# Altium schematic sheet ESQUEMÁTICOAUTOOSCILANTE.SchDoc
size A4; SheetNumber: 1; SheetTotal: 1
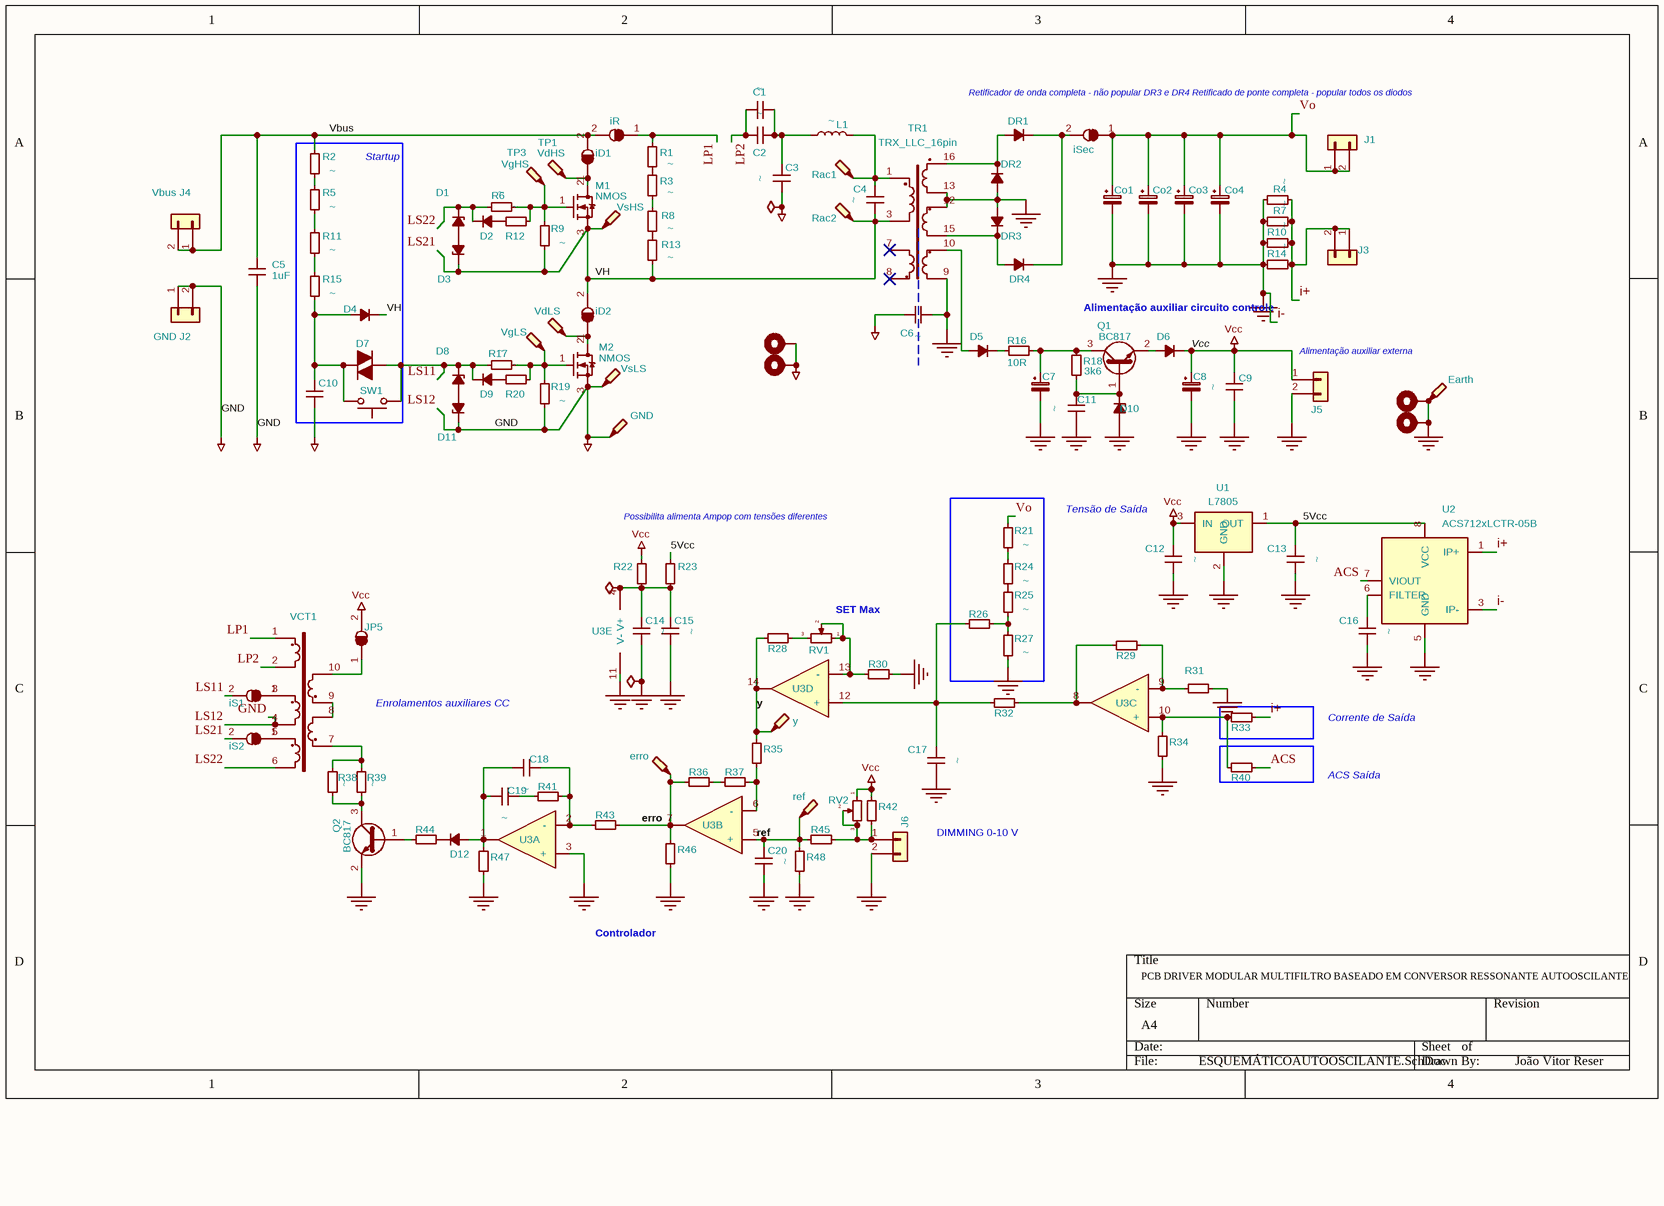
[diagram p0: ESQUEMÁTICOAUTOOSCILANTE.SchDoc]

## Parts
#FLG?#1  PWR_FLAG  (value not drawn)  (graphical)
#FLG?#2  PWR_FLAG  (value not drawn)  (graphical)
#FLG?#3  PWR_FLAG  (value not drawn)  (graphical)
C1  ~  [C_Rect_L18.0mm_W5.0mm_P15.00mm_FKS3_FKP3]
C2  ~  [C_Rect_L18.0mm_W5.0mm_P15.00mm_FKS3_FKP3]
C3  ~  [C_Rect_L18.0mm_W5.0mm_P15.00mm_FKS3_FKP3]
C4  ~  [C_Rect_L18.0mm_W5.0mm_P15.00mm_FKS3_FKP3]
C5  1uF  [C_Rect_L31.5mm_W11.0mm_P27.50mm_MKS4]
C6  ~  [C_Rect_L10.0mm_W4.0mm_P7.50mm_MKS4]
C7  C_Polarized_Small  [CP_Elec_6.3x5.7]  (value not drawn)
C8  C_Polarized_Small  [CP_Elec_6.3x5.7]  (value not drawn)
C9  ~  [C_0805_2012Metric_Pad1.18x1.45mm_HandSolder]
C10  C_Small  [C_1206_3216Metric_Pad1.33x1.80mm_HandSolder]  (value not drawn)
C11  ~  [C_0805_2012Metric_Pad1.18x1.45mm_HandSolder]
C12  ~  [C_0805_2012Metric_Pad1.18x1.45mm_HandSolder]
C13  ~  [C_0805_2012Metric_Pad1.18x1.45mm_HandSolder]
C14  ~  [C_0805_2012Metric_Pad1.18x1.45mm_HandSolder]
C15  ~  [C_0805_2012Metric_Pad1.18x1.45mm_HandSolder]
C16  ~  [C_0805_2012Metric_Pad1.18x1.45mm_HandSolder]
C17  ~  [C_0805_2012Metric_Pad1.18x1.45mm_HandSolder]
C18  ~  [C_0805_2012Metric_Pad1.18x1.45mm_HandSolder]
C19  ~  [C_0805_2012Metric_Pad1.18x1.45mm_HandSolder]
C20  ~  [C_0805_2012Metric_Pad1.18x1.45mm_HandSolder]
Co1  C_Polarized_Small  [CP_Radial_D10.0mm_P5.00mm]  (value not drawn)
Co2  C_Polarized_Small  [CP_Radial_D10.0mm_P5.00mm]  (value not drawn)
Co3  C_Polarized_Small  [CP_Radial_D10.0mm_P5.00mm]  (value not drawn)
Co4  C_Polarized_Small  [CP_Radial_D10.0mm_P5.00mm]  (value not drawn)
D1  D_Zener_Small_Filled  [D_MELF-RM10_Universal_Handsoldering]  (value not drawn)
D2  D_Small_Filled  [D_SMA_Handsoldering]  (value not drawn)
D3  D_Zener_Small_Filled  [D_MELF-RM10_Universal_Handsoldering]  (value not drawn)
D4  D_Small_Filled  [D_DO-41_SOD81_P7.62mm_Horizontal]  (value not drawn)
D5  D_Small_Filled  [D_SMA_Handsoldering]  (value not drawn)
D6  D_Small_Filled  [D_SMA_Handsoldering]  (value not drawn)
D7  DIAC  [D_DO-35_SOD27_P7.62mm_Horizontal]  (value not drawn)
D8  D_Zener_Small_Filled  [D_MELF-RM10_Universal_Handsoldering]  (value not drawn)
D9  D_Small_Filled  [D_SMA_Handsoldering]  (value not drawn)
D10  D_Zener_Small_Filled  [D_SMA_Handsoldering]  (value not drawn)
D11  D_Zener_Small_Filled  [D_MELF-RM10_Universal_Handsoldering]  (value not drawn)
D12  D_Small_Filled  [D_SMA_Handsoldering]  (value not drawn)
DR1  D_Small_Filled  [D_SMC-RM10_Universal_Handsoldering]  (value not drawn)
DR2  D_Small_Filled  [D_SMC-RM10_Universal_Handsoldering]  (value not drawn)
DR3  D_Small_Filled  [D_SMC-RM10_Universal_Handsoldering]  (value not drawn)
DR4  D_Small_Filled  [D_SMC-RM10_Universal_Handsoldering]  (value not drawn)
H1  GND  [MountingHole_3.2mm_M3_Pad_Via]  (value not drawn)
H2  GND  [MountingHole_3.2mm_M3_Pad_Via]  (value not drawn)
H3  GND  [MountingHole_3.2mm_M3_Pad_Via]  (value not drawn)
H4  GND  [MountingHole_3.2mm_M3_Pad_Via]  (value not drawn)
J1  Conn_01x02  [Faston_5mm]  (value not drawn)
J2  Vbus  [Faston_5mm]
J3  Conn_01x02  [Faston_5mm]  (value not drawn)
J4  GND  [Faston_5mm]
J5  Conn_01x02  [KRE02]  (value not drawn)
J6  Conn_01x02  [KRE02]  (value not drawn)
JP1  iR  [Jumper_Corrente_1mm]
JP2  iD1  [Jumper_Corrente_1mm]
JP3  iSec  [Jumper_Corrente_1mm]
JP4  iD2  [Jumper_Corrente_1mm]
JP5  SolderJumper_2_Open  [Jumper_Corrente_1mm]  (value not drawn)
JP6  iS1  [Jumper_Corrente_1mm]
JP7  iS2  [Jumper_Corrente_1mm]
L1  ~  [EFD_25_13_09_PIN-1-2-10]
M1  NMOS  [TO-252-2]
M2  NMOS  [TO-252-2]
Q1  BC817  [SOT-23]
Q2  BC817  [SOT-23]
R1  ~  [R_1206_3216Metric_Pad1.30x1.75mm_HandSolder]
R2  ~  [R_1206_3216Metric_Pad1.30x1.75mm_HandSolder]
R3  ~  [R_1206_3216Metric_Pad1.30x1.75mm_HandSolder]
R4  ~  [R_1206_3216Metric_Pad1.30x1.75mm_HandSolder]
R5  ~  [R_1206_3216Metric_Pad1.30x1.75mm_HandSolder]
R6  ~  [R_0805_2012Metric_Pad1.20x1.40mm_HandSolder]
R7  ~  [R_1206_3216Metric_Pad1.30x1.75mm_HandSolder]
R8  ~  [R_1206_3216Metric_Pad1.30x1.75mm_HandSolder]
R9  ~  [R_0805_2012Metric_Pad1.20x1.40mm_HandSolder]
R10  ~  [R_1206_3216Metric_Pad1.30x1.75mm_HandSolder]
R11  ~  [R_1206_3216Metric_Pad1.30x1.75mm_HandSolder]
R12  ~  [R_0805_2012Metric_Pad1.20x1.40mm_HandSolder]
R13  ~  [R_1206_3216Metric_Pad1.30x1.75mm_HandSolder]
R14  ~  [R_1206_3216Metric_Pad1.30x1.75mm_HandSolder]
R15  ~  [R_1206_3216Metric_Pad1.30x1.75mm_HandSolder]
R16  10R  [R_1206_3216Metric_Pad1.30x1.75mm_HandSolder]
R17  ~  [R_0805_2012Metric_Pad1.20x1.40mm_HandSolder]
R18  3k6  [R_0805_2012Metric_Pad1.20x1.40mm_HandSolder]
R19  ~  [R_0805_2012Metric_Pad1.20x1.40mm_HandSolder]
R20  ~  [R_0805_2012Metric_Pad1.20x1.40mm_HandSolder]
R21  ~  [R_1206_3216Metric_Pad1.30x1.75mm_HandSolder]
R22  10R  [R_0805_2012Metric_Pad1.20x1.40mm_HandSolder]  (value not drawn)
R23  10R  [R_0805_2012Metric_Pad1.20x1.40mm_HandSolder]  (value not drawn)
R24  ~  [R_1206_3216Metric_Pad1.30x1.75mm_HandSolder]
R25  ~  [R_1206_3216Metric_Pad1.30x1.75mm_HandSolder]
R26  10R  [R_0805_2012Metric_Pad1.20x1.40mm_HandSolder]  (value not drawn)
R27  ~  [R_1206_3216Metric_Pad1.30x1.75mm_HandSolder]
R28  10R  [R_0805_2012Metric_Pad1.20x1.40mm_HandSolder]  (value not drawn)
R29  10R  [R_0805_2012Metric_Pad1.20x1.40mm_HandSolder]  (value not drawn)
R30  10R  [R_0805_2012Metric_Pad1.20x1.40mm_HandSolder]  (value not drawn)
R31  10R  [R_0805_2012Metric_Pad1.20x1.40mm_HandSolder]  (value not drawn)
R32  10R  [R_0805_2012Metric_Pad1.20x1.40mm_HandSolder]  (value not drawn)
R33  10R  [R_0805_2012Metric_Pad1.20x1.40mm_HandSolder]  (value not drawn)
R34  10R  [R_0805_2012Metric_Pad1.20x1.40mm_HandSolder]  (value not drawn)
R35  10R  [R_0805_2012Metric_Pad1.20x1.40mm_HandSolder]  (value not drawn)
R36  10R  [R_0805_2012Metric_Pad1.20x1.40mm_HandSolder]  (value not drawn)
R37  10R  [R_0805_2012Metric_Pad1.20x1.40mm_HandSolder]  (value not drawn)
R38  ~  [R_1206_3216Metric_Pad1.30x1.75mm_HandSolder]
R39  ~  [R_1206_3216Metric_Pad1.30x1.75mm_HandSolder]
R40  10R  [R_0805_2012Metric_Pad1.20x1.40mm_HandSolder]  (value not drawn)
R41  10R  [R_0805_2012Metric_Pad1.20x1.40mm_HandSolder]  (value not drawn)
R42  10R  [R_0805_2012Metric_Pad1.20x1.40mm_HandSolder]  (value not drawn)
R43  10R  [R_0805_2012Metric_Pad1.20x1.40mm_HandSolder]  (value not drawn)
R44  10R  [R_1206_3216Metric_Pad1.30x1.75mm_HandSolder]  (value not drawn)
R45  10R  [R_0805_2012Metric_Pad1.20x1.40mm_HandSolder]  (value not drawn)
R46  10R  [R_0805_2012Metric_Pad1.20x1.40mm_HandSolder]  (value not drawn)
R47  10R  [R_0805_2012Metric_Pad1.20x1.40mm_HandSolder]  (value not drawn)
R48  10R  [R_0805_2012Metric_Pad1.20x1.40mm_HandSolder]  (value not drawn)
RV1  R_Potentiometer_Small  [Potentiometer_Bourns_3296W_Vertical]  (value not drawn)
RV2  R_Potentiometer_Small  [Potentiometer_Bourns_3296W_Vertical]  (value not drawn)
SW1  SW_Push  [SW_SPST_PTS645]  (value not drawn)
TP1  VdHS  [TestPoint_Loop_D1.80mm_Drill1.0mm_Beaded]
TP2  Rac1  [TestPoint_Loop_D1.80mm_Drill1.0mm_Beaded]
TP3  VgHS  [TestPoint_Loop_D1.80mm_Drill1.0mm_Beaded]
TP4  Rac2  [TestPoint_Loop_D1.80mm_Drill1.0mm_Beaded]
TP5  VsHS  [TestPoint_Loop_D1.80mm_Drill1.0mm_Beaded]
TP6  VdLS  [TestPoint_Loop_D1.80mm_Drill1.0mm_Beaded]
TP7  VgLS  [TestPoint_Loop_D1.80mm_Drill1.0mm_Beaded]
TP8  VsLS  [TestPoint_Loop_D1.80mm_Drill1.0mm_Beaded]
TP9  Earth  [TestPoint_Loop_D1.80mm_Drill1.0mm_Beaded]
TP10  GND  [TestPoint_Loop_D1.80mm_Drill1.0mm_Beaded]
TP11  y  [Test Pad SMD]
TP12  erro  [Test Pad SMD]
TP13  ref  [Test Pad SMD]
TR1  TRX_LLC_16pin  [EE_35_18_12]
U1  L7805  [TO-252-3_TabPin2]
U2  ACS712xLCTR-05B  [SOIC-8_3.9x4.9mm_P1.27mm]
U3  Opamp_Quad  [SOIC-14_3.9x8.7mm_P1.27mm]  (value not drawn)  (parts A,B,C,D,E of 5)
VCT1  VCT  [Toroidal_2xD12.5mm_VCT]  (value not drawn)

## Blocks framed on the sheet
Startup: C10 D4 D7 R2 R5 R11 R15 SW1

## Nets
GND: #FLG?#1.1 C3.1 C5.2 C6.2 C10.2 D11.1(K) H1.1 H2.1 J4.1(Pin_1) J4.2(Pin_2) M2.3(S) R19.2 TP8.1 TP10.1 VCT1.4  [also labelled LS12]
i-: #FLG?#3.1 C6.1 C7.2 C8.2 C9.1 C11.1 C12.2 C13.2 C14.2 C15.2 C16.2 C17.2 C20.2 Co1.2 Co2.2 Co3.2 Co4.2 D10.2(A) DR2.2(A) DR3.2(A) H3.1 H4.1 J5.2(Pin_2) J6.2(Pin_2) Q2.2(E) R4.1 R7.1 R10.1 R14.1 R27.2 R30.1 R31.2 R34.1 R46.1 R47.1 R48.1 TP9.1 TR1.9 TR1.12 TR1.13 U1.2(GND) U2.3(IP-) U2.5(GND) U3.3(+) U3.11(V-)  [also labelled Earth]
Vcc: C8.1 C9.2 C12.1 D6.1(K) J5.1(Pin_1) JP5.2(B) R22.2 R42.2 RV2.1 U1.3(IN)
5Vcc: C13.1 R23.2 U1.1(OUT) U2.8(VCC)
ACS: R40.2 U2.7(VIOUT)
erro: R36.1 R43.2 R46.2 TP12.1 U3.7
i+: J3.1(Pin_1) J3.2(Pin_2) R4.2 R7.2 R10.2 R14.2 R33.2 U2.1(IP+)
LP1: JP1.1(A) R1.1 VCT1.1
LP2: C1.1 C2.1 VCT1.2
LS11: D7.2(A) D8.1(K) D9.1(K) JP6.2(B) R17.1 SW1.2
LS21: C4.1 D3.1(K) D4.1(K) JP4.2(B) JP7.2(B) M1.3(S) R9.2 R13.2 TP4.1 TP5.1 TR1.3  [also labelled VH]
LS22: D1.1(K) D2.1(K) R6.1 VCT1.6
ref: C20.1 R45.1 R48.2 TP13.1 U3.5(+)
Vbus: C5.1 J2.1(Pin_1) J2.2(Pin_2) JP1.2(B) JP2.2(B) R2.1
Vo: Co1.1 Co2.1 Co3.1 Co4.1 J1.1(Pin_1) J1.2(Pin_2) JP3.1(A) R21.1
y: R28.1 R35.2 TP11.1 U3.14
Net#FLG?#2_1: #FLG?#2.1 C14.1 C15.1 R22.1 R23.1 U3.4(V+)
NetC1_2: C1.2 C2.2 C3.2 L1.2
NetC4_2: C4.2 L1.1 TP2.1 TR1.1
NetC7_1: C7.1 Q1.3(C) R16.2 R18.2
NetC10_1: C10.1 D4.2(A) D7.1(K) R15.2 SW1.1
NetC11_2: C11.2 D10.1(K) Q1.1(B) R18.1
NetC16_1: C16.1 U2.6(FILTER)
NetC17_1: C17.1 R26.2 R32.1 U3.12(+)
NetC18_1: C18.1 R41.2 R43.1 U3.2(-)
NetC18_2: C18.2 C19.2 D12.2(A) R47.2 U3.1
NetC19_1: C19.1 R41.1
NetD1_2: D1.2(A) D3.2(A)
NetD2_2: D2.2(A) R12.1
NetD5_1: D5.1(K) R16.1
NetD5_2: D5.2(A) TR1.10
NetD6_2: D6.2(A) Q1.2(E)
NetD8_2: D8.2(A) D11.2(A)
NetD9_2: D9.2(A) R20.1
NetD12_1: D12.1(K) R44.2
NetDR1_1: DR1.1(K) DR4.1(K) JP3.2(B)
NetDR1_2: DR1.2(A) DR2.1(K) TR1.16
NetDR3_1: DR3.1(K) DR4.2(A) TR1.15
NetJ6_1: J6.1(Pin_1) R42.1 R45.2 RV2.2 RV2.3
NetJP2_1: JP2.1(A) M1.2(D) TP1.1
NetJP4_1: JP4.1(A) M2.2(D) TP6.1
NetJP5_1: JP5.1(A) VCT1.10
NetJP6_1: JP6.1(A) VCT1.3
NetJP7_1: JP7.1(A) VCT1.5
NetM1_1: M1.1(G) R6.2 R9.1 R12.2 TP3.1
NetM2_1: M2.1(G) R17.2 R19.1 R20.2 TP7.1
NetQ2_1: Q2.1(B) R44.1
NetQ2_3: Q2.3(C) R38.1 R39.1
NetR1_2: R1.2 R3.1
NetR2_2: R2.2 R5.1
NetR3_2: R3.2 R8.1
NetR5_2: R5.2 R11.1
NetR8_2: R8.2 R13.1
NetR11_2: R11.2 R15.1
NetR21_2: R21.2 R24.1
NetR24_2: R24.2 R25.1
NetR25_2: R25.2 R26.1 R27.1
NetR28_2: R28.2 RV1.3
NetR29_1: R29.1 R32.2 U3.8
NetR29_2: R29.2 R31.1 U3.9(-)
NetR30_2: R30.2 RV1.1 RV1.2 U3.13(-)
NetR33_1: R33.1 R34.2 R40.1 U3.10(+)
NetR35_1: R35.1 R37.2 U3.6(-)
NetR36_2: R36.2 R37.1
NetR38_2: R38.2 R39.2 VCT1.7
NetVCT1_8: VCT1.8 VCT1.9

Not connected (* = marked no-connect by the designer): TR1 2 4 5 6 7* 8* 11; U2 2(IP+) 4(IP-)

## Notes on the sheet
- Retificador de onda completa
  - não popular DR3 e DR4
  Retificado de ponte completa
  - popular todos os diodos
- Alimentação auxiliar circuito controle
- (near J5) Alimentação auxiliar
  externa
- Possibilita alimenta
  Ampop com tensões
  diferentes
- Tensão de Saída
- (near RV1) SET Max
- Enrolamentos
  auxiliares CC
- Corrente de Saída
- DIMMING
  0-10 V
- ACS
  Saída
- Controlador
- PCB DRIVER MODULAR MULTIFILTRO BASEADO EM CONVERSOR RESSONANTE AUTOOSCILANTE
- João Vitor Reser

## Library data of the parts
C1-C6 C9 C11-C20 = C_Small
  C1-C4: Value: ~; Footprint: Capacitor_THT:C_Rect_L18.0mm_W5.0mm_P15.00mm_FKS3_FKP3
  C5: Value: 1uF; Footprint: Capacitor_THT:C_Rect_L31.5mm_W11.0mm_P27.50mm_MKS4
  C6: Value: ~; Footprint: Capacitor_THT:C_Rect_L10.0mm_W4.0mm_P7.50mm_MKS4
  C9 C11-C20: Value: ~; Footprint: Capacitor_SMD:C_0805_2012Metric_Pad1.18x1.45mm_HandSolder
D2 D4-D6 D9 D12 DR1-DR4 = D_Small_Filled: Sim.Device: D; Sim.Pins: 1=K 2=A; Value: D_Small_Filled
  D2 D5 D6 D9 D12: Footprint: Diode_SMD:D_SMA_Handsoldering
  D4: Footprint: Diode_THT:D_DO-41_SOD81_P7.62mm_Horizontal
  DR1-DR4: Footprint: Diode_SMD:D_SMC-RM10_Universal_Handsoldering
H1-H4 = MountingHole_Pad: Value: GND; Footprint: MountingHole:MountingHole_3.2mm_M3_Pad_Via
J2 J4 = Conn_01x02: Footprint: GSEC:Faston_5mm
  J2: Value: Vbus
  J4: Value: GND
JP1-JP4 JP6 JP7 = SolderJumper_2_Open: Footprint: GSEC:Jumper_Corrente_1mm
  JP1: Value: iR
  JP2: Value: iD1
  JP3: Value: iSec
  JP4: Value: iD2
  JP6: Value: iS1
  JP7: Value: iS2
L1 = L: Value: ~; Footprint: GSEC:EFD_25_13_09_PIN-1-2-10
R1-R48 = R_Small
  R1-R5 R7 R8 R10 R11 R13-R15 R21 R24 R25 R27 R38 R39: Value: ~; Footprint: Resistor_SMD:R_1206_3216Metric_Pad1.30x1.75mm_HandSolder
  R6 R9 R12 R17 R19 R20: Value: ~; Footprint: Resistor_SMD:R_0805_2012Metric_Pad1.20x1.40mm_HandSolder
  R16 R44: Value: 10R; Footprint: Resistor_SMD:R_1206_3216Metric_Pad1.30x1.75mm_HandSolder
  R18: Value: 3k6; Footprint: Resistor_SMD:R_0805_2012Metric_Pad1.20x1.40mm_HandSolder
  R22 R23 R26 R28-R37 R40-R43 R45-R48: Value: 10R; Footprint: Resistor_SMD:R_0805_2012Metric_Pad1.20x1.40mm_HandSolder
TP1-TP13 = TestPoint_Probe
  TP1: Value: VdHS; Footprint: TestPoint:TestPoint_Loop_D1.80mm_Drill1.0mm_Beaded
  TP2: Value: Rac1; Footprint: TestPoint:TestPoint_Loop_D1.80mm_Drill1.0mm_Beaded
  TP3: Value: VgHS; Footprint: TestPoint:TestPoint_Loop_D1.80mm_Drill1.0mm_Beaded
  TP4: Value: Rac2; Footprint: TestPoint:TestPoint_Loop_D1.80mm_Drill1.0mm_Beaded
  TP5: Value: VsHS; Footprint: TestPoint:TestPoint_Loop_D1.80mm_Drill1.0mm_Beaded
  TP6: Value: VdLS; Footprint: TestPoint:TestPoint_Loop_D1.80mm_Drill1.0mm_Beaded
  TP7: Value: VgLS; Footprint: TestPoint:TestPoint_Loop_D1.80mm_Drill1.0mm_Beaded
  TP8: Value: VsLS; Footprint: TestPoint:TestPoint_Loop_D1.80mm_Drill1.0mm_Beaded
  TP9: Value: Earth; Footprint: TestPoint:TestPoint_Loop_D1.80mm_Drill1.0mm_Beaded
  TP10: Value: GND; Footprint: TestPoint:TestPoint_Loop_D1.80mm_Drill1.0mm_Beaded
  TP11: Value: y; Footprint: GSEC:Test Pad SMD
  TP12: Value: erro; Footprint: GSEC:Test Pad SMD
  TP13: Value: ref; Footprint: GSEC:Test Pad SMD
TR1 = TRX_LLC_16pin_2aux: Value: TRX_LLC_16pin; Footprint: GSEC:EE_35_18_12
U3 = Opamp_Quad: Sim.Library: ${KICAD7_SYMBOL_DIR}/Simulation_SPICE.sp; Sim.Name: kicad_builtin_opamp_quad; Sim.Device: SUBCKT; Sim.Pins: 1=out1 2=in1- 3=in1+ 4=vcc 5=in2+ 6=in2- 7=out2 8=out3 9=in3- 10=in3+ 11=vee 12=in4+ 13=in4- 14=out4; Value: Opamp_Quad; Footprint: Package_SO:SOIC-14_3.9x8.7mm_P1.27mm
VCT1 = CT_LP_LS1_LS2_Laux: Value: VCT; Footprint: GSEC:Toroidal_2xD12.5mm_VCT
#FLG?#1-#FLG?#3 = PWR_FLAG: Value: PWR_FLAG
C7 C8 Co1-Co4 = C_Polarized_Small: Value: C_Polarized_Small
  C7 C8: Footprint: Capacitor_SMD:CP_Elec_6.3x5.7
  Co1-Co4: Footprint: Capacitor_THT:CP_Radial_D10.0mm_P5.00mm
C10 = C_Small: Value: C_Small; Footprint: Capacitor_SMD:C_1206_3216Metric_Pad1.33x1.80mm_HandSolder
D1 D3 D8 D10 D11 = D_Zener_Small_Filled: Value: D_Zener_Small_Filled
  D1 D3 D8 D11: Footprint: Diode_SMD:D_MELF-RM10_Universal_Handsoldering
  D10: Footprint: Diode_SMD:D_SMA_Handsoldering
D7 = DIAC: Value: DIAC; Footprint: Diode_THT:D_DO-35_SOD27_P7.62mm_Horizontal
J1 J3 J5 J6 = Conn_01x02: Value: Conn_01x02
  J1 J3: Footprint: GSEC:Faston_5mm
  J5 J6: Footprint: GSEC:KRE02
JP5 = SolderJumper_2_Open: Value: SolderJumper_2_Open; Footprint: GSEC:Jumper_Corrente_1mm
M1 M2 = NMOS: Value: NMOS; Footprint: Package_TO_SOT_SMD:TO-252-2
Q1 Q2 = BC817: Value: BC817; Footprint: Package_TO_SOT_SMD:SOT-23
RV1 RV2 = R_Potentiometer_Small: Value: R_Potentiometer_Small; Footprint: Potentiometer_THT:Potentiometer_Bourns_3296W_Vertical
SW1 = SW_Push: Value: SW_Push; Footprint: Button_Switch_SMD:SW_SPST_PTS645
U1 = L7805: Value: L7805; Footprint: Package_TO_SOT_SMD:TO-252-3_TabPin2
U2 = ACS712xLCTR-05B: Value: ACS712xLCTR-05B; Footprint: Package_SO:SOIC-8_3.9x4.9mm_P1.27mm